# EAGLE design stoneWeather (EAGLE 7.6.0)
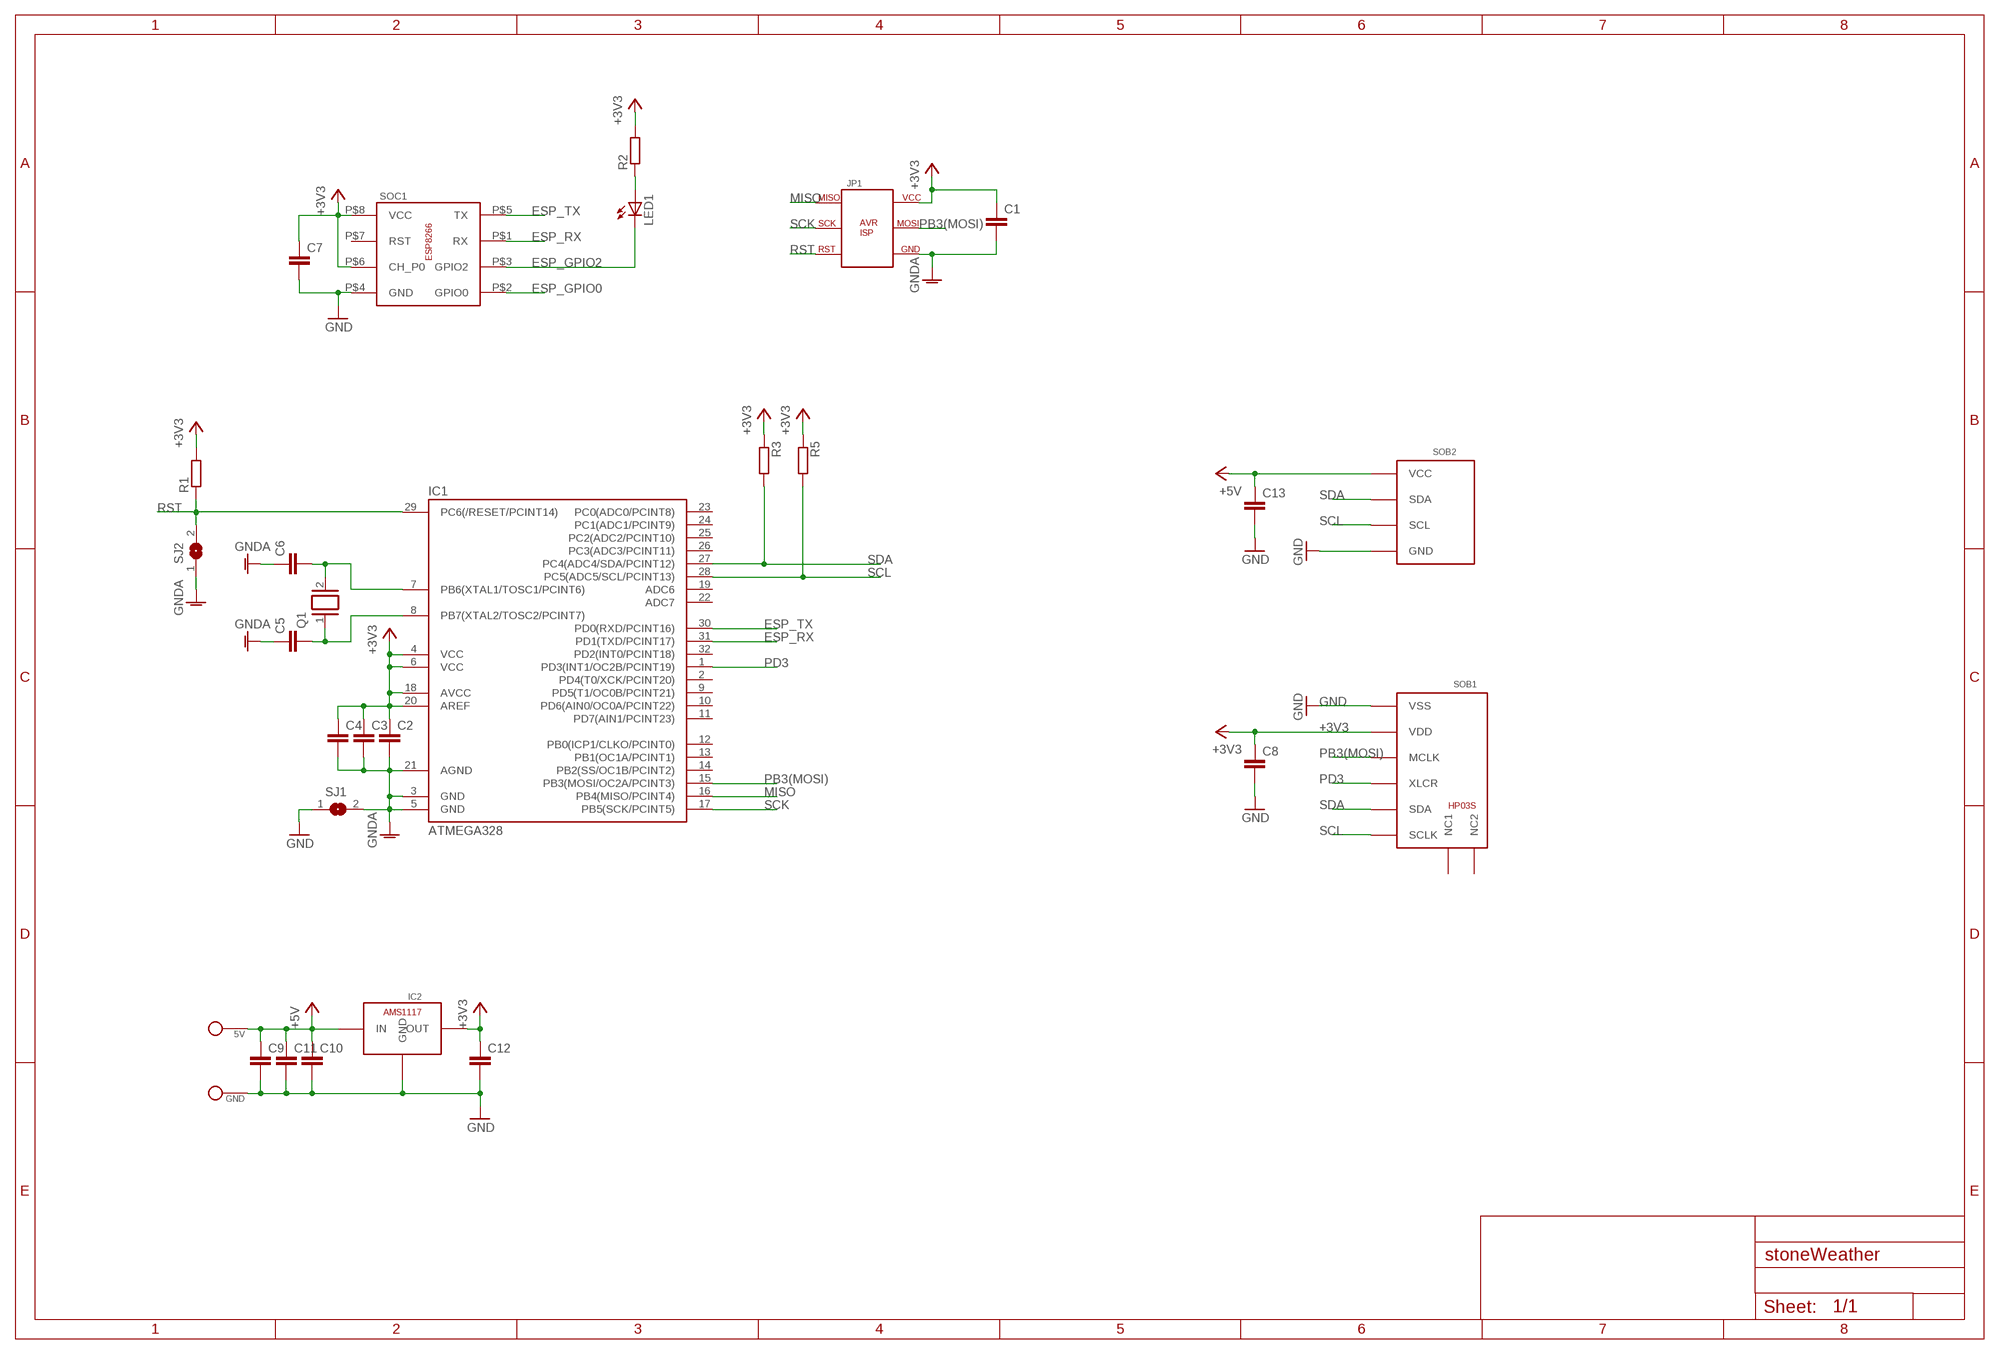
[diagram p0: schematic, sheet 1]

## Parts
5V  PAD_254X508  [PAD_254X508]
C1  C-EUC0805  [C0805]
C2  C-EUC0805  [C0805]
C3  C-EUC0805  [C0805]
C4  C-EUC0805  [C0805]
C5  C-EUC0805  [C0805]
C6  C-EUC0805  [C0805]
C7  C-EUC0805  [C0805]
C8  C-EUC0805  [C0805]
C9  C-EUC0805  [C0805]
C10  C-EUC0805  [C0805]
C11  C-EUC0805  [C0805]
C12  C-EUC0805  [C0805]
C13  C-EUC0805  [C0805]
GND  PAD_254X508  [PAD_254X508]
IC1  ATMEGA328  ATMEGA48/88/168-AU  [TQFP32-08]
IC2  AMS1117  [AMS1117]
JP1  AVR_ISPSINGLESIDED_SMD  [PINHEADER_254_2X3_SMD]
LED1  LED3MM  [LED3MM]
Q1  XTAL/S  [QS]
R1  R-EU_M0805  [M0805]
R2  R-EU_M0805  [M0805]
R3  R-EU_M0805  [M0805]
R5  R-EU_M0805  [M0805]
SJ1  SJ  [SJ]
SJ2  SJ  [SJ]
SOB1  HP03S  [HP03S]
SOB2  GY21_HTU21  [GY21-HTU21]
SOC1  ESP8266PINHEADER_SMD  [ESP8266]

## Nets
+3V3: C1.1 C2.1 C3.1 C4.1 C7.1 C8.1 C12.1 IC1.4(VCC) IC1.6(VCC) IC1.18(AVCC) IC1.20(AREF) IC2.OUT JP1.P$8(VCC) R1.2 R2.2 R3.1 R5.1 SOB1.VDD SOC1.P$6(CH_P0) SOC1.P$8(VCC)
+5V: 5V.P$1 C9.1 C10.1 C11.1 C13.1 IC2.IN SOB2.P$4(VCC)
ESP_GPIO0: SOC1.P$2(GPIO0)
ESP_GPIO2: LED1.K(C) SOC1.P$3(GPIO2)
ESP_RX: IC1.31(PD1(TXD/PCINT17)) SOC1.P$1(RX)
ESP_TX: IC1.30(PD0(RXD/PCINT16)) SOC1.P$5(TX)
GND: C7.2 C8.2 C9.2 C10.2 C11.2 C12.2 C13.2 GND.P$1 IC2.GND SJ1.1 SOB1.VSS SOB2.P$3(GND) SOC1.P$4(GND)
GNDA: C1.2 C2.2 C3.2 C4.2 C5.1 C6.1 IC1.3(GND) IC1.5(GND) IC1.21(AGND) JP1.P$6(GND) SJ1.2 SJ2.1
MISO: IC1.16(PB4(MISO/PCINT4)) JP1.P$1(MISO)
N$1: LED1.A R2.1
N$3: C5.2 IC1.8(PB7(XTAL2/TOSC2/PCINT7)) Q1.1
N$4: C6.2 IC1.7(PB6(XTAL1/TOSC1/PCINT6)) Q1.2
PB3(MOSI): IC1.15(PB3(MOSI/OC2A/PCINT3)) JP1.P$7(MOSI) SOB1.MCLK
PD3: IC1.1(PD3(INT1/OC2B/PCINT19)) SOB1.XCLR(XLCR)
RST: IC1.29(PC6(/RESET/PCINT14)) JP1.P$3(RST) R1.1 SJ2.2
SCK: IC1.17(PB5(SCK/PCINT5)) JP1.P$2(SCK)
SCL: IC1.28(PC5(ADC5/SCL/PCINT13)) R5.2 SOB1.SCLK SOB2.P$2(SCL)
SDA: IC1.27(PC4(ADC4/SDA/PCINT12)) R3.2 SOB1.SDA SOB2.P$1(SDA)
Unconnected: IC1.2(PD4(T0/XCK/PCINT20)) IC1.9(PD5(T1/OC0B/PCINT21)) IC1.10(PD6(AIN0/OC0A/PCINT22)) IC1.11(PD7(AIN1/PCINT23)) IC1.12(PB0(ICP1/CLKO/PCINT0)) IC1.13(PB1(OC1A/PCINT1)) IC1.14(PB2(SS/OC1B/PCINT2)) IC1.19(ADC6) IC1.22(ADC7) IC1.23(PC0(ADC0/PCINT8)) IC1.24(PC1(ADC1/PCINT9)) IC1.25(PC2(ADC2/PCINT10)) IC1.26(PC3(ADC3/PCINT11)) IC1.32(PD2(INT0/PCINT18)) SOB1.NC1 SOB1.NC2 SOC1.P$7(RST)

## Library data of the parts
5V GND = stoneTronics:PAD
C1-C13 = rcl:C-EU: CAPACITOR, European symbol
IC1 = atmega8:ATMEGA48/88/168
IC2 = stoneTronics:AMS1117
JP1 = stoneTronics:AVR_ISP
LED1 = led:LED: LED OSRAM: - CHIPLED LG R971, LG N971, LY N971, LG Q971, LY Q971, LO R971, LY R971 LH N974, LH R974 LS Q976, LO Q976, LY Q976 LO Q996 - Hyper CHIPLED LW Q18S LB Q993, LB Q99A, LB R99A - SideLED LS A670, LO A670, LY A670, LG A670, LP A670 LB A673, LV A673, LT A673, LW A673 LH A674 LY A675 LS A676, LA A676, LO A676, LY A676, LW A676 LS A679, LY A679, LG A679 - Hyper Micro SIDELED® LS Y876, LA Y876, LO Y876, LY Y876 LT Y87S - SmartLED LW L88C, LW L88S LB L89C, LB L89S, LG L890 LS L89K, LO L89K, LY L89K LS L896, LA L896, LO L896, LY L896 - TOPLED LS T670, LO T670, LY T670, LG T670, LP T670 LSG T670, LSP T670, LSY T670, LOP T670, LYG T670 LG T671, LOG T671, LSG T671 LB T673, LV T673, LT T673, LW T673 LH T674 LS T676, LA T676, LO T676, LY T676, LB T676, LH T676, LSB T676, LW T676 LB T67C, LV T67C, LT T67C, LS T67K, LO T67K, LY T67K, LW E67C LS E67B, LA E67B, LO E67B, LY E67B, LB E67C, LV E67C, LT E67C LW T67C LS T679, LY T679, LG T679 LS T770, LO T770, LY T770, LG T770, LP T770 LB T773, LV T773, LT T773, LW T773 LH T774 LS E675, LA E675, LY E675, LS T675 LS T776, LA T776, LO T776, LY T776, LB T776 LHGB T686 LT T68C, LB T68C - Hyper Mini TOPLED® LB M676 - Mini TOPLED Santana® LG M470 LS M47K, LO M47K, LY M47K Source: http://www.osram.convergy.de LUXEON: - LUMILED® LXK2-PW12-R00, LXK2-PW12-S00, LXK2-PW14-U00, LXK2-PW14-V00 LXK2-PM12-R00, LXK2-PM12-S00, LXK2-PM14-U00 LXK2-PE12-Q00, LXK2-PE12-R00, LXK2-PE12-S00, LXK2-PE14-T00, LXK2-PE14-U00 LXK2-PB12-K00, LXK2-PB12-L00, LXK2-PB12-M00, LXK2-PB14-N00, LXK2-PB14-P00, LXK2-PB14-Q00 LXK2-PR12-L00, LXK2-PR12-M00, LXK2-PR14-Q00, LXK2-PR14-R00 LXK2-PD12-Q00, LXK2-PD12-R00, LXK2-PD12-S00 LXK2-PH12-R00, LXK2-PH12-S00 LXK2-PL12-P00, LXK2-PL12-Q00, LXK2-PL12-R00 Source: www.luxeon.com KINGBRIGHT: KA-3528ASYC Source: www.kingbright.com
Q1 = special:XTAL/S: CRYSTAL
R1-R3 R5 = rcl:R-EU_: RESISTOR, European symbol
SJ1 SJ2 = jumper:SJ: SMD solder JUMPER
SOB1 = stoneTronics:HP03S
SOB2 = stoneTronics:GY21_HTU21
SOC1 = stoneTronics:ESP8266

## Board
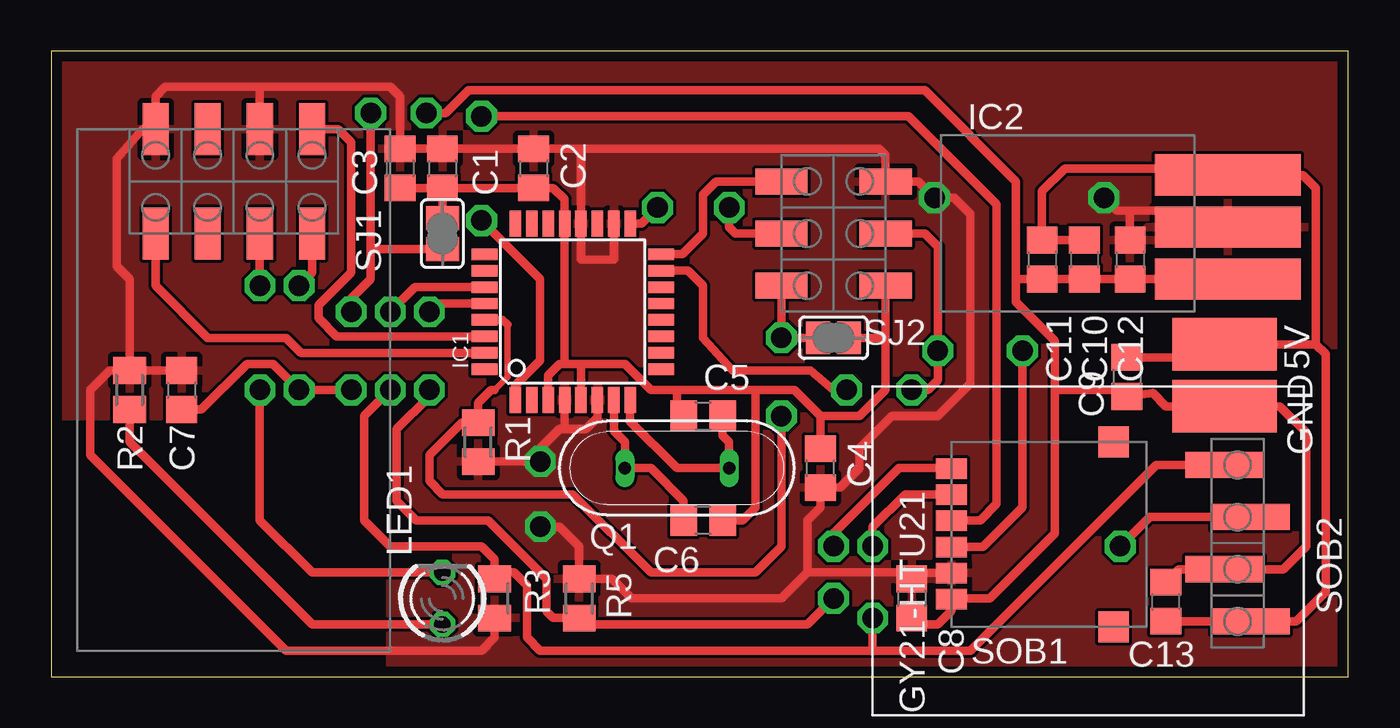
[diagram p1: board, top side]
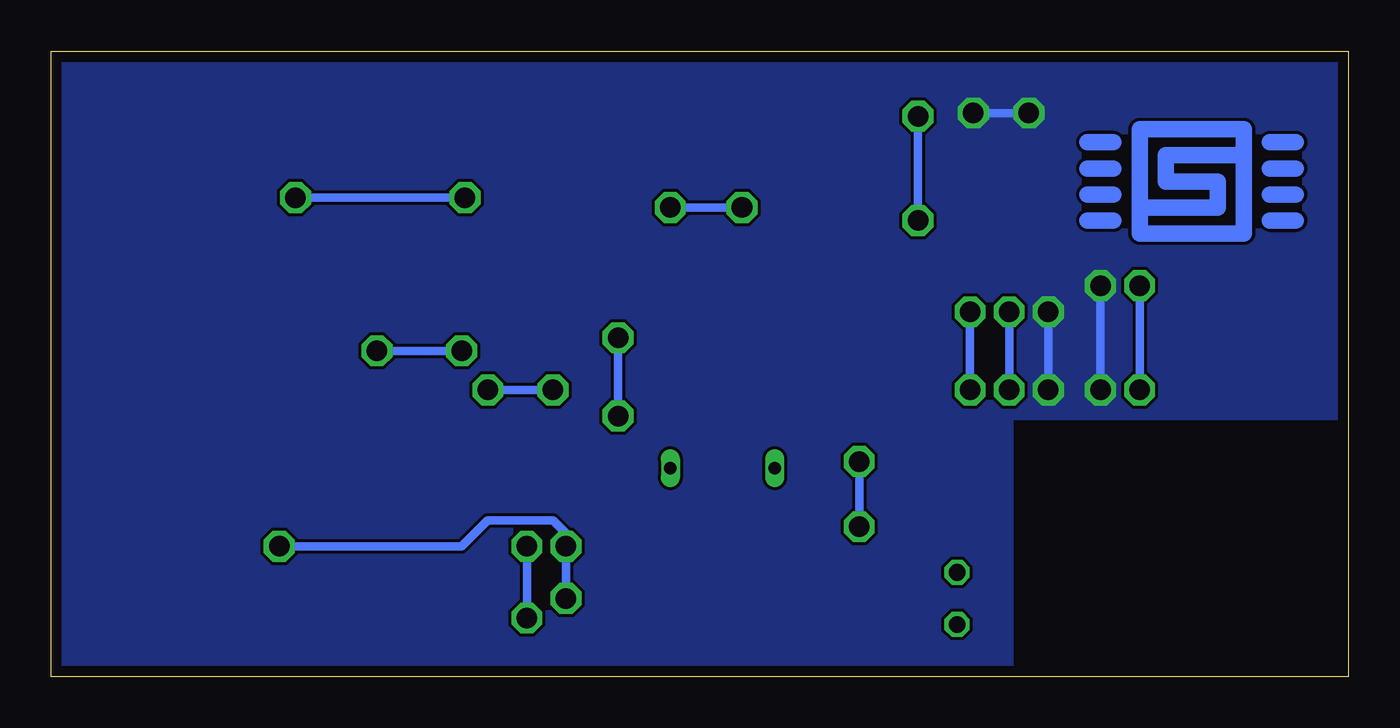
[diagram p2: board, bottom side, seen from below]

Size 63.17 x 30.47 mm. Coordinates in mm from the lower left corner, seen from the top.
Outline: 0,0 63.17,0 63.17,30.47 0,30.47 0,0
Copper layers (1*16): Top 0.035mm / dielectric 1.6mm / Bottom 0.035mm
Design rules "Elecrow_2-layer_PCB_eagle_rule": minimum track width 6mil, minimum drill 12mil, track to track 6mil, track to pad 6mil, pad to pad 6mil, via to via 8mil, smd to smd 0mil, copper to edge 20mil, drill to drill 10mil, minimum pad ring 6mil, minimum via ring 6mil, stop-mask expansion 0mil, vias tented up to drill 100mil, thermal gap 10mil

### Footprints (pad centres in the part's own frame; a part is rotated, then mirrored left to right if it is on the bottom)
PAD_254X508 = smd 2.54 x 5.08: P$1 0,0
C0805 = smd 1.3 x 1.5: 1 -0.95,0; 2 0.95,0
TQFP32-08 = smd 1.27 x 0.559: 1 -4.293,2.8; 2 -4.293,2; 3 -4.293,1.2; 4 -4.293,0.4; 5 -4.293,-0.4; 6 -4.293,-1.2; 7 -4.293,-2; 8 -4.293,-2.8; 17 4.293,-2.8; 18 4.293,-2; 19 4.293,-1.2; 20 4.293,-0.4; 21 4.293,0.4; 22 4.293,1.2; 23 4.293,2; 24 4.293,2.8 | smd 0.559 x 1.27: 9 -2.8,-4.293; 10 -2,-4.293; 11 -1.2,-4.293; 12 -0.4,-4.293; 13 0.4,-4.293; 14 1.2,-4.293; 15 2,-4.293; 16 2.8,-4.293; 25 2.8,4.293; 26 2,4.293; 27 1.2,4.293; 28 0.4,4.293; 29 -0.4,4.293; 30 -1.2,4.293; 31 -2,4.293; 32 -2.8,4.293
AMS1117 = smd 7.12 x 2: GND 13.97,1.587; IN 13.97,6.668; OUT 13.97,4.128
PINHEADER_254_2X3_SMD = smd 1.27 x 2.54: P$1 -3.81,-1.27; P$2 -1.27,-1.27; P$3 1.27,-1.27; P$6 1.27,3.81; P$7 -1.27,3.81; P$8 -3.81,3.81
LED3MM = drill 0.813 octagon: A -1.27,0; K 1.27,0
QS = drill 0.61 long: 1 -2.54,0; 2 2.54,0
M0805 = smd 1.3 x 1.6: 1 -0.95,0; 2 0.95,0
SJ = smd 1.168 x 1.6: 1 -0.762,0; 2 0.762,0
HP03S = smd 1.5 x 1: MCLK 9.5,5.11; SCLK 9.5,1.3; SDA 9.5,2.57; VDD 9.5,6.38; VSS 9.5,7.65; XCLR 9.5,3.84 | smd 1.5 x 1.5: NC1 1.6,9; NC2 1.6,0
GY21-HTU21 = smd 1.27 x 3.81: P$1 -3.81,6.985; P$2 -1.27,8.255; P$3 1.27,6.985; P$4 3.81,8.255
ESP8266 = smd 1.27 x 2.54: P$1 -3.81,-2.54; P$2 -1.27,-2.54; P$3 1.27,-2.54; P$4 3.81,-2.54; P$5 3.81,2.54; P$6 1.27,2.54; P$7 -1.27,2.54; P$8 -3.81,2.54

### Placement (x,y rotation side)
5V  57.15,16.19 90 top
C1  19.05,24.77 270 top
C2  23.5,24.77 270 top
C3  16.99,24.77 270 top
C4  37.47,10.16 90 top
C5  31.75,12.7 0 top
C6  31.75,7.62 180 top
C7  6.35,13.97 270 top
C8  41.91,3.81 270 top
C9  52.39,14.61 270 top
C10  50.32,20.32 270 top
C11  48.26,20.32 270 top
C12  52.55,20.32 270 top
C13  54.29,3.65 90 top
GND  57.15,13.18 90 top
IC1  25.4,17.78 90 top
IC2  43.34,17.78 0 top
JP1  36.83,20.32 270 top
LED1  19.05,3.81 90 top
Q1  30.48,10.16 180 top
R1  20.8,11.43 270 top
R2  3.81,13.97 90 top
R3  21.59,3.81 90 top
R5  25.72,3.81 270 top
SJ1  19.05,21.59 90 top
SJ2  38.1,16.51 180 top
SOB1  53.34,11.43 180 top
SOB2  50.16,6.51 270 top
SOC1  8.89,24.13 0 top

### Tracks (layer width: path | path; a pad name or v marks a point on that pad's centre or on a via)
+3V3  (via drill 1 pad 1.27)
  Top 0.406: IC1.4 25,12.06 | 25,12.06 26.04,12.06 26.6,12.63 IC1.6 26.67,13.42 | R1.2 v23.82,10.48 23.82,11.12 24.77,12.06 25,12.06 | v23.82,7.3 24.77,7.3 25.72,6.35 R5.1 25.4,4.76 27.3,4.76 28.26,3.81 35.56,3.81 36.83,5.08 | 36.83,5.08 36.83,7.62 37.47,8.26 C4.1 38.42,9.21 39.37,10.16 39.37,11.11 40.96,12.7 43.18,12.7 44.77,14.29 44.77,22.54 43.97,23.34 v43.02,23.34 42.23,24.13 JP1.P$8 40.64,25.4 40.33,25.71 25.8,25.71 | IC1.18 27.4,20.32 25.8,20.32 IC1.20 25.8,25.71 | C3.1 C2.1 25.8,25.71 | 18.1,25.71 C1.1 C3.1 | 16.83,25.71 C3.1 | R2.2 C7.1 | R3.1 21.59,1.91 20.95,1.27 11.43,1.27 1.91,10.79 1.91,13.97 2.85,14.92 R2.2 | R2.2 3.81,19.37 3.17,20 3.17,25.24 4.45,26.67 SOC1.P$8 5.08,28.26 5.56,28.73 10.16,28.73 | 41.91,5.05 C8.1 41.91,5.08 36.83,5.08 | 41.91,5.05 SOB1.VDD | 41.91,5.05 41.88,5.08 | C3.1 16.99,28.26 16.51,28.73 10.16,28.73 | IC2.OUT 56.52,22.7 52.55,22.7 | v51.28,23.34 51.91,22.7 52.55,22.7 | C12.1 52.55,22.7 | SOC1.P$6 10.16,28.73
  Bottom 0.406: v23.82,10.48 v23.82,7.3 | v51.28,23.34 v43.02,23.34
  pour Top: 0,30.48 63.5,30.48 63.5,0 16.51,0 16.51,12.7 0,12.7
+5V
  Top 0.406: C10.1 C11.1 48.26,23.65 49.37,24.77 57.31,24.77 IC2.IN 60.96,24.45 61.59,23.81 61.59,16.19 | 5V.P$1 59.37,15.24 | C9.1 58.42,15.56 5V.P$1 | 61.59,16.19 62.07,15.72 62.07,4.13 60.65,2.7 58.9,2.7 SOB2.P$4 C13.1 | 61.59,16.19 5V.P$1
ESP_GPIO2  (via drill 1 pad 1.27)
  Top 0.406: v10.16,19.05 SOC1.P$3 | v10.16,13.97 10.16,7.62 12.7,5.08 LED1.K
  Bottom 0.406: v10.16,13.97 v10.16,19.05
ESP_RX
  Top 0.406: SOC1.P$1 5.08,19.05 7.62,16.51 11.43,16.51 12.16,15.78 IC1.31
ESP_TX
  Top 0.406: IC1.30 13.9,16.58 13.02,17.46 13.02,18.1 14.61,19.68 14.61,26.04 13.97,26.67 SOC1.P$5
GND  (via drill 1 pad 1.27)
  Top 0.406: v14.61,13.97 v12.06,13.97 10.79,15.24 9.53,15.24 7.31,13.02 C7.2 | v14.61,17.78 14.61,18.41 15.56,19.37 15.56,20.83 | v12.06,19.05 12.7,19.68 SOC1.P$4 | C8.2 arc90 42.23,2.54 43.18,2.54 43.84,3.2 SOB1.VSS 43.87,3.81 45.72,3.81 48.9,6.99 48.9,13.97 | 15.56,20.83 v15.56,27.46 | v18.26,27.46 19.21,27.46 20.32,28.57 42.55,28.57 46.99,24.13 46.99,19.37 | 46.99,19.37 46.99,18.26 48.9,16.35 48.9,13.97 | 46.99,19.37 C11.2 C10.2 C12.2 | IC2.GND C12.2 | 48.9,13.97 52.39,13.97 C9.2 53.66,13.81 54.29,13.18 GND.P$1 59.85,13.18 61.12,11.91 61.12,6.35 60.01,5.24 SOB2.P$3 54.93,5.24 C13.2 | C12.2 | SJ1.1 15.56,20.83
  Bottom 0.406: v14.61,17.78 v14.61,13.97 | v12.06,19.05 v12.06,13.97 | v15.56,27.46 v18.26,27.46
  pour Bottom: 0,12.7 0,30.48 63.5,30.48 63.5,0 16.51,0 16.51,12.7
GNDA
  Top 0.406: IC1.3 24.2,14.68 24.77,15.24 25,15.24 | IC1.5 25.8,15.24 | 25,15.24 IC1.21 25,23.26 24.45,23.82 C2.2 C1.2 | 25.8,15.24 27.94,15.24 29.21,13.97 30.48,13.97 | 30.48,13.97 34.29,13.97 | C5.1 30.48,13.02 30.48,13.97 | C6.1 33.66,7.62 34.29,8.26 34.29,13.97 | 40.64,16.51 40.64,13.97 39.37,12.7 37.47,12.7 | 40.64,16.51 JP1.P$6 | 25.8,15.24 25,15.24 | C1.2 C3.2 | 34.29,13.97 36.2,13.97 37.47,12.7 | C4.2 37.47,12.7 | SJ2.1 40.64,16.51 | SJ1.2 C1.2
MISO
  Top 0.406: JP1.P$1 32.38,24.13 31.75,23.5 31.75,21.59 30.74,20.58 IC1.16
N$1
  Top 0.406: R2.1 3.81,11.43 12.7,2.54 LED1.A
N$3
  Top 0.406: IC1.8 28.2,12.44 30.48,10.16 Q1.1 33.02,11.43 32.7,11.75 C5.2
N$4
  Top 0.406: IC1.7 27.4,11.97 27.94,11.43 Q1.2 29.21,10.16 30.8,8.57 C6.2
N$5
  Bottom 0.813: 5.08,25.4 5.08,26.67 10.16,26.67 10.16,22.86 | 5.08,25.4 5.08,21.59 10.16,21.59 10.16,22.86 | 5.08,25.4 8.89,25.4 8.89,24.13 6.35,24.13 6.35,22.86 10.16,22.86
N$6
  Bottom 0.813: 3.81,22.23 2.54,22.23
N$7
  Bottom 0.813: 3.81,23.5 2.54,23.5
N$8
  Bottom 0.813: 3.81,24.77 2.54,24.77
N$9
  Bottom 0.813: 3.81,26.04 2.54,26.04
N$10
  Bottom 0.813: 11.43,26.04 12.7,26.04
N$11
  Bottom 0.813: 11.43,24.77 12.7,24.77
N$12
  Bottom 0.813: 11.43,23.5 12.7,23.5
N$13
  Bottom 0.813: 11.43,22.23 12.7,22.23
PB3(MOSI)  (via drill 1 pad 1.27)
  Top 0.406: JP1.P$7 42.55,21.59 43.18,20.95 v43.18,15.88 43.18,14.45 42.7,13.97 v41.91,13.97 | IC1.15 31.02,19.78 31.75,19.05 31.75,16.51 33.18,14.92 36.99,14.92 38.1,13.97 v38.73,13.97 | SOB1.MCLK 45.37,6.32 47.31,8.26 v47.31,15.88
  Bottom 0.406: v41.91,13.97 v38.73,13.97 | v47.31,15.88 v43.18,15.88
PD3  (via drill 1 pad 1.27)
  Top 0.406: IC1.1 22.6,14.19 23.81,15.4 23.81,19.37 v20.95,22.23 | v20.95,27.3 41.75,27.3 46.04,23.02 46.04,8.41 45.24,7.62 43.87,7.62 SOB1.XCLR
  Bottom 0.406: v20.95,22.23 v20.95,27.3
RST  (via drill 1 pad 1.27)
  Top 0.305: 21.59,13.97 22.23,14.61 22.23,17.14
  Top 0.406: 21.59,13.97 21.43,13.97 20.8,13.34 R1.1 20,12.38 18.41,10.79 18.41,9.53 19.05,8.89 25.4,8.89 29.21,5.08 34.29,5.08 35.56,6.35 v35.56,12.7 | 22.23,17.14 21.99,17.38 IC1.29 | JP1.P$3 v35.56,16.51 SJ2.2
  Bottom 0.406: v35.56,16.51 v35.56,12.7
SCK  (via drill 1 pad 1.27)
  Top 0.406: v29.53,22.86 28.74,22.07 IC1.17 | v33.02,22.86 33.02,21.91 33.34,21.59 JP1.P$2
  Bottom 0.406: v33.02,22.86 v29.53,22.86
SCL  (via drill 1 pad 1.27)
  Top 0.406: IC1.28 18.82,18.18 v18.41,17.78 | v18.41,13.97 18.41,13.65 16.83,12.06 16.83,8.57 17.78,7.62 21.27,7.62 24.13,4.76 24.13,3.17 24.45,2.86 25.4,2.86 R5.2 25.72,2.54 36.83,2.54 v38.1,3.81 | v38.1,6.35 38.1,6.99 41.27,10.16 43.81,10.16 SOB1.SCLK | v52.07,6.35 53.5,7.78 SOB2.P$2
  Bottom 0.406: v18.41,17.78 v18.41,13.97 | v38.1,3.81 v38.1,6.35 38.1,6.99 38.73,7.62 41.91,7.62 43.18,6.35 v52.07,6.35
SDA  (via drill 1 pad 1.27)
  Top 0.406: IC1.27 17.71,18.98 v16.51,17.78 | v16.51,13.97 15.24,12.7 15.24,7.62 16.51,6.35 20.95,6.35 21.59,5.71 21.59,5.08 | 21.59,5.08 R3.2 | 21.59,5.08 22.54,5.08 23.18,4.45 23.18,1.91 23.81,1.27 40.01,1.27 | 40.01,1.27 v40.01,2.86 | v40.01,6.35 40.01,7.3 41.59,8.89 43.81,8.89 SOB1.SDA | 40.01,1.27 44.77,1.27 53.82,10.32 SOB2.P$1
  Bottom 0.406: v16.51,17.78 v16.51,13.97 | v40.01,2.86 v40.01,6.35

### Text on the board
tDocu: STONEWEATHER | github.com/stonetronics | MISO | SCK | RST